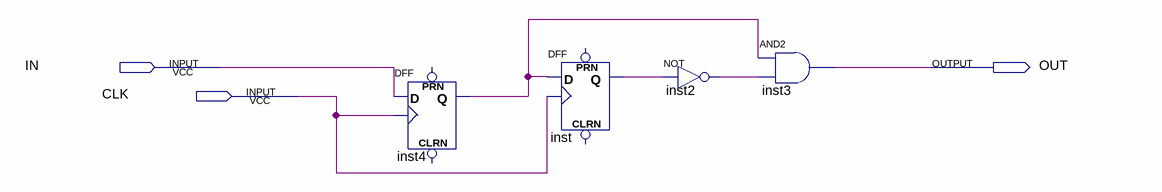
[diagram p0: schematic sheet]
// Quartus schematic R_E_D.bdf as structural Verilog: 4 symbols, 3 pins
module R_E_D (
  input  IN,
  input  CLK,
  output OUT
);

  wire inst2_out, inst4_q, inst_q;

  DFF inst4 (.CLK(CLK), .D(IN), .Q(inst4_q));  // open: CLRN, PRN
  DFF inst (.CLK(CLK), .D(inst4_q), .Q(inst_q));  // open: CLRN, PRN
  not inst2 (inst2_out, inst_q);
  and inst3 (OUT, inst4_q, inst2_out);
endmodule
